# Altium schematic sheet PROB_S7CAS_FPGA_2.SchDoc
size Tabloid; SheetNumber: 6; SheetTotal: 15; Sheet_Name: Bank FPGA (2/3); Size: 11x17
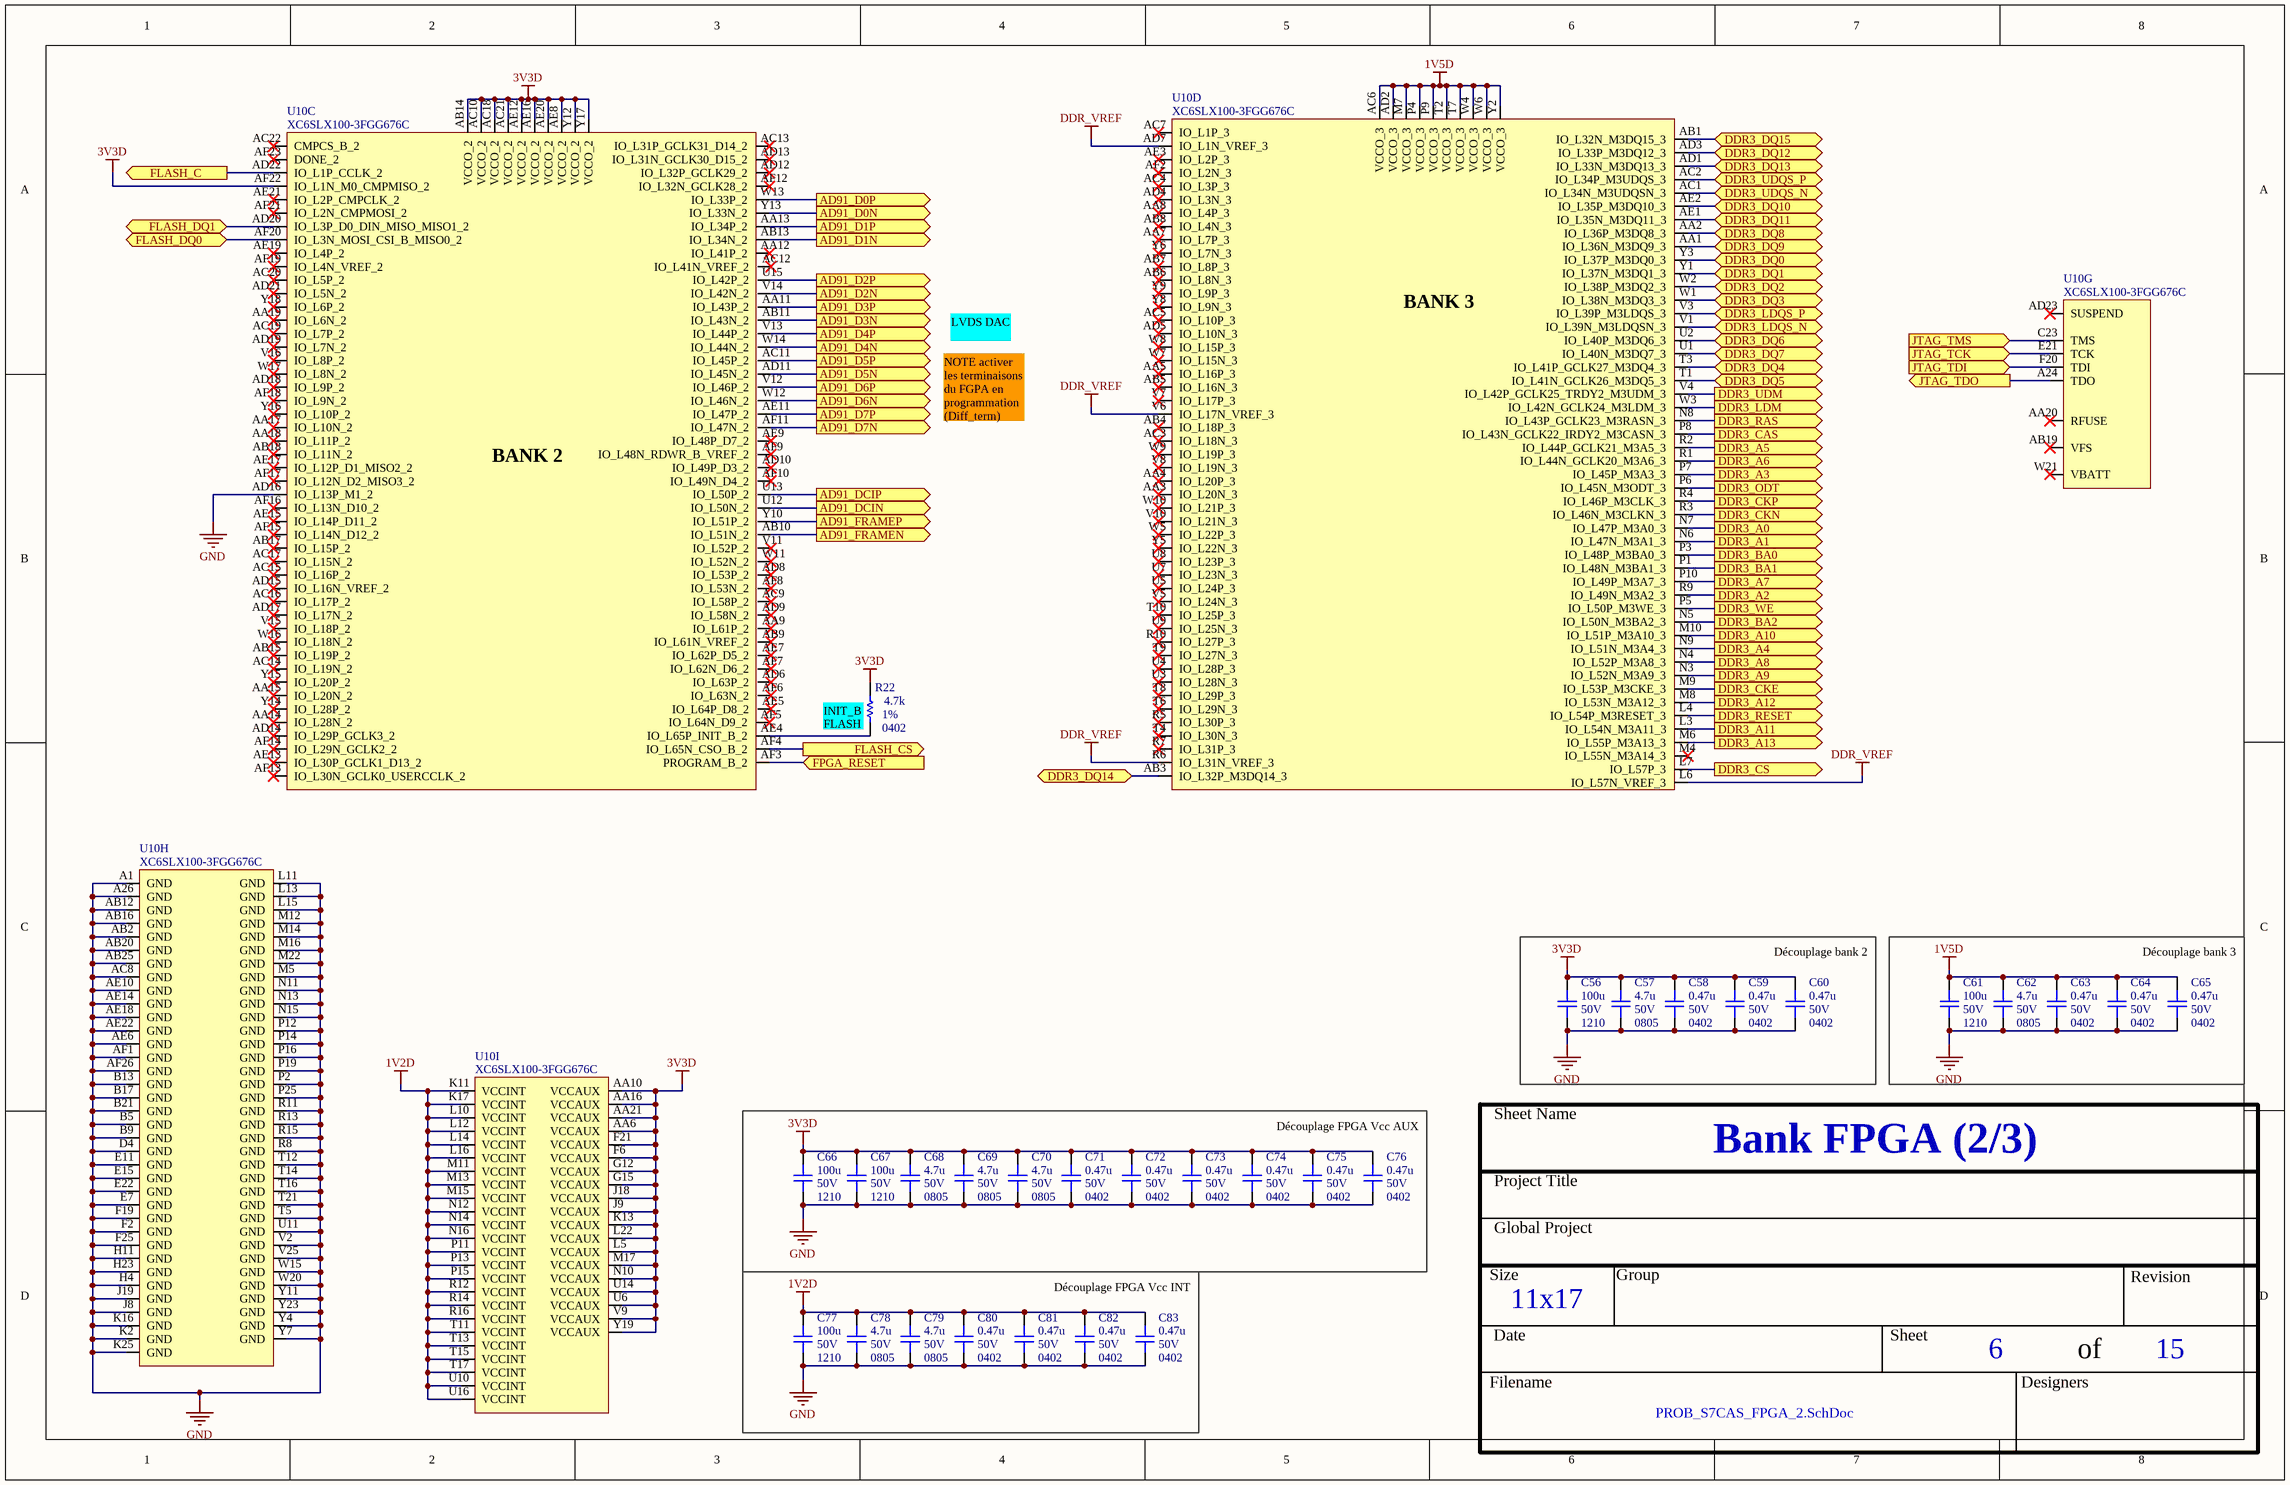
[diagram p0: PROB_S7CAS_FPGA_2.SchDoc]

## Parts
C56  value 100u  Voltage: 50V  Package: 1210  [CAP_1210]  (hidden comment: CAP - 1210)
C57  value 4.7u  Voltage: 50V  Package: 0805  [CAP_0805]  (hidden comment: CAP - 0805)
C58  value 0.47u  Voltage: 50V  Package: 0402  [CAP_0402]  (hidden comment: CAP - 0402)
C59  value 0.47u  Voltage: 50V  Package: 0402  [CAP_0402]  (hidden comment: CAP - 0402)
C60  value 0.47u  Voltage: 50V  Package: 0402  [CAP_0402]  (hidden comment: CAP - 0402)
C61  value 100u  Voltage: 50V  Package: 1210  [CAP_1210]  (hidden comment: CAP - 1210)
C62  value 4.7u  Voltage: 50V  Package: 0805  [CAP_0805]  (hidden comment: CAP - 0805)
C63  value 0.47u  Voltage: 50V  Package: 0402  [CAP_0402]  (hidden comment: CAP - 0402)
C64  value 0.47u  Voltage: 50V  Package: 0402  [CAP_0402]  (hidden comment: CAP - 0402)
C65  value 0.47u  Voltage: 50V  Package: 0402  [CAP_0402]  (hidden comment: CAP - 0402)
C66  value 100u  Voltage: 50V  Package: 1210  [CAP_1210]  (hidden comment: CAP - 1210)
C67  value 100u  Voltage: 50V  Package: 1210  [CAP_1210]  (hidden comment: CAP - 1210)
C68  value 4.7u  Voltage: 50V  Package: 0805  [CAP_0805]  (hidden comment: CAP - 0805)
C69  value 4.7u  Voltage: 50V  Package: 0805  [CAP_0805]  (hidden comment: CAP - 0805)
C70  value 4.7u  Voltage: 50V  Package: 0805  [CAP_0805]  (hidden comment: CAP - 0805)
C71  value 0.47u  Voltage: 50V  Package: 0402  [CAP_0402]  (hidden comment: CAP - 0402)
C72  value 0.47u  Voltage: 50V  Package: 0402  [CAP_0402]  (hidden comment: CAP - 0402)
C73  value 0.47u  Voltage: 50V  Package: 0402  [CAP_0402]  (hidden comment: CAP - 0402)
C74  value 0.47u  Voltage: 50V  Package: 0402  [CAP_0402]  (hidden comment: CAP - 0402)
C75  value 0.47u  Voltage: 50V  Package: 0402  [CAP_0402]  (hidden comment: CAP - 0402)
C76  value 0.47u  Voltage: 50V  Package: 0402  [CAP_0402]  (hidden comment: CAP - 0402)
C77  value 100u  Voltage: 50V  Package: 1210  [CAP_1210]  (hidden comment: CAP - 1210)
C78  value 4.7u  Voltage: 50V  Package: 0805  [CAP_0805]  (hidden comment: CAP - 0805)
C79  value 4.7u  Voltage: 50V  Package: 0805  [CAP_0805]  (hidden comment: CAP - 0805)
C80  value 0.47u  Voltage: 50V  Package: 0402  [CAP_0402]  (hidden comment: CAP - 0402)
C81  value 0.47u  Voltage: 50V  Package: 0402  [CAP_0402]  (hidden comment: CAP - 0402)
C82  value 0.47u  Voltage: 50V  Package: 0402  [CAP_0402]  (hidden comment: CAP - 0402)
C83  value 0.47u  Voltage: 50V  Package: 0402  [CAP_0402]  (hidden comment: CAP - 0402)
R22  value 4.7k  Package: 0402  Precision: 1%  [RES_0402]  (hidden comment: RES - 0402)
U10  XC6SLX100-3FGG676C  [FPGA_XILINX_FGG676]  (parts C,D,G,H,I of 10)

## Ports
AD91_D0N (out), AD91_D0P (out), AD91_D1N (out), AD91_D1P (out), AD91_D2N (out), AD91_D2P (out), AD91_D3N (out), AD91_D3P (out), AD91_D4N (out), AD91_D4P (out), AD91_D5N (out), AD91_D5P (out), AD91_D6N (out), AD91_D6P (out), AD91_D7N (out), AD91_D7P (out), AD91_DCIN (out), AD91_DCIP (out), AD91_FRAMEN (out), AD91_FRAMEP (out), DDR3_A0 (out), DDR3_A1 (out), DDR3_A2 (out), DDR3_A3 (out), DDR3_A4 (out), DDR3_A5 (out), DDR3_A6 (out), DDR3_A7 (out), DDR3_A8 (out), DDR3_A9 (out), DDR3_A10 (out), DDR3_A11 (out), DDR3_A12 (out), DDR3_A13 (out), DDR3_BA0 (out), DDR3_BA1 (out), DDR3_BA2 (out), DDR3_CAS (out), DDR3_CKE (out), DDR3_CKN (out), DDR3_CKP (out), DDR3_CS (out), DDR3_DQ0 (bidir), DDR3_DQ1 (bidir), DDR3_DQ2 (bidir), DDR3_DQ3 (bidir), DDR3_DQ4 (bidir), DDR3_DQ5 (bidir), DDR3_DQ6 (bidir), DDR3_DQ7 (bidir), DDR3_DQ8 (bidir), DDR3_DQ9 (bidir), DDR3_DQ10 (bidir), DDR3_DQ11 (bidir), DDR3_DQ12 (bidir), DDR3_DQ13 (bidir), DDR3_DQ14 (bidir), DDR3_DQ15 (bidir), DDR3_LDM (out), DDR3_LDQS_N (bidir), DDR3_LDQS_P (bidir), DDR3_ODT (out), DDR3_RAS (out), DDR3_RESET (out), DDR3_UDM (out), DDR3_UDQS_N (bidir), DDR3_UDQS_P (bidir), DDR3_WE (out), FLASH_C (out), FLASH_CS (out), FLASH_DQ0 (bidir), FLASH_DQ1 (bidir), FPGA_RESET (in), JTAG_TCK (in), JTAG_TDI (in), JTAG_TDO (out), JTAG_TMS (in)

## Nets
1V2D: C77.2 C78.2 C79.2 C80.2 C81.2 C82.2 C83.2 U10.K11(VCCINT) U10.K17(VCCINT) U10.L10(VCCINT) U10.L12(VCCINT) U10.L14(VCCINT) U10.L16(VCCINT) U10.M11(VCCINT) U10.M13(VCCINT) U10.M15(VCCINT) U10.N12(VCCINT) U10.N14(VCCINT) U10.N16(VCCINT) U10.P11(VCCINT) U10.P13(VCCINT) U10.P15(VCCINT) U10.R12(VCCINT) U10.R14(VCCINT) U10.R16(VCCINT) U10.T11(VCCINT) U10.T13(VCCINT) U10.T15(VCCINT) U10.T17(VCCINT) U10.U10(VCCINT) U10.U16(VCCINT)
1V5D: C61.2 C62.2 C63.2 C64.2 C65.2 U10.AC6(VCCO_3) U10.AD2(VCCO_3) U10.M7(VCCO_3) U10.P4(VCCO_3) U10.P9(VCCO_3) U10.T2(VCCO_3) U10.T7(VCCO_3) U10.W4(VCCO_3) U10.W6(VCCO_3) U10.Y2(VCCO_3)
3V3D: C56.2 C57.2 C58.2 C59.2 C60.2 C66.2 C67.2 C68.2 C69.2 C70.2 C71.2 C72.2 C73.2 C74.2 C75.2 C76.2 R22.2 U10.AA6(VCCAUX) U10.AA10(VCCAUX) U10.AA16(VCCAUX) U10.AA21(VCCAUX) U10.AB14(VCCO_2) U10.AC10(VCCO_2) U10.AC18(VCCO_2) U10.AC21(VCCO_2) U10.AE8(VCCO_2) U10.AE12(VCCO_2) U10.AE16(VCCO_2) U10.AE20(VCCO_2) U10.AF22(IO_L1N_M0_CMPMISO_2) U10.F6(VCCAUX) U10.F21(VCCAUX) U10.G12(VCCAUX) U10.G15(VCCAUX) U10.J9(VCCAUX) U10.J18(VCCAUX) U10.K13(VCCAUX) U10.L5(VCCAUX) U10.L22(VCCAUX) U10.M17(VCCAUX) U10.N10(VCCAUX) U10.U6(VCCAUX) U10.U14(VCCAUX) U10.V9(VCCAUX) U10.Y12(VCCO_2) U10.Y17(VCCO_2) U10.Y19(VCCAUX)
DDR_VREF: U10.AD7(IO_L1N_VREF_3) U10.L6(IO_L57N_VREF_3) U10.R6(IO_L31N_VREF_3) U10.V6(IO_L17N_VREF_3)
GND: C56.1 C57.1 C58.1 C59.1 C60.1 C61.1 C62.1 C63.1 C64.1 C65.1 C66.1 C67.1 C68.1 C69.1 C70.1 C71.1 C72.1 C73.1 C74.1 C75.1 C76.1 C77.1 C78.1 C79.1 C80.1 C81.1 C82.1 C83.1 U10.A1(GND) U10.A26(GND) U10.AB2(GND) U10.AB12(GND) U10.AB16(GND) U10.AB20(GND) U10.AB25(GND) U10.AC8(GND) U10.AD16(IO_L13P_M1_2) U10.AE6(GND) U10.AE10(GND) U10.AE14(GND) U10.AE18(GND) U10.AE22(GND) U10.AF1(GND) U10.AF26(GND) U10.B5(GND) U10.B9(GND) U10.B13(GND) U10.B17(GND) U10.B21(GND) U10.D4(GND) U10.E7(GND) U10.E11(GND) U10.E15(GND) U10.E22(GND) U10.F2(GND) U10.F19(GND) U10.F25(GND) U10.H4(GND) U10.H11(GND) U10.H23(GND) U10.J8(GND) U10.J19(GND) U10.K2(GND) U10.K16(GND) U10.K25(GND) U10.L11(GND) U10.L13(GND) U10.L15(GND) U10.M5(GND) U10.M12(GND) U10.M14(GND) U10.M16(GND) U10.M22(GND) U10.N11(GND) U10.N13(GND) U10.N15(GND) U10.P2(GND) U10.P12(GND) U10.P14(GND) U10.P16(GND) U10.P19(GND) U10.P25(GND) U10.R8(GND) U10.R11(GND) U10.R13(GND) U10.R15(GND) U10.T5(GND) U10.T12(GND) U10.T14(GND) U10.T16(GND) U10.T21(GND) U10.U11(GND) U10.V2(GND) U10.V25(GND) U10.W15(GND) U10.W20(GND) U10.Y4(GND) U10.Y7(GND) U10.Y11(GND) U10.Y23(GND)
AD91_D0N: U10.Y13(IO_L33N_2) ; port AD91_D0N
AD91_D0P: U10.W13(IO_L33P_2) ; port AD91_D0P
AD91_D1N: U10.AB13(IO_L34N_2) ; port AD91_D1N
AD91_D1P: U10.AA13(IO_L34P_2) ; port AD91_D1P
AD91_D2N: U10.V14(IO_L42N_2) ; port AD91_D2N
AD91_D2P: U10.U15(IO_L42P_2) ; port AD91_D2P
AD91_D3N: U10.AB11(IO_L43N_2) ; port AD91_D3N
AD91_D3P: U10.AA11(IO_L43P_2) ; port AD91_D3P
AD91_D4N: U10.W14(IO_L44N_2) ; port AD91_D4N
AD91_D4P: U10.V13(IO_L44P_2) ; port AD91_D4P
AD91_D5N: U10.AD11(IO_L45N_2) ; port AD91_D5N
AD91_D5P: U10.AC11(IO_L45P_2) ; port AD91_D5P
AD91_D6N: U10.W12(IO_L46N_2) ; port AD91_D6N
AD91_D6P: U10.V12(IO_L46P_2) ; port AD91_D6P
AD91_D7N: U10.AF11(IO_L47N_2) ; port AD91_D7N
AD91_D7P: U10.AE11(IO_L47P_2) ; port AD91_D7P
AD91_DCIN: U10.U12(IO_L50N_2) ; port AD91_DCIN
AD91_DCIP: U10.U13(IO_L50P_2) ; port AD91_DCIP
AD91_FRAMEN: U10.AB10(IO_L51N_2) ; port AD91_FRAMEN
AD91_FRAMEP: U10.Y10(IO_L51P_2) ; port AD91_FRAMEP
DDR3_A0: U10.N7(IO_L47P_M3A0_3) ; port DDR3_A0
DDR3_A1: U10.N6(IO_L47N_M3A1_3) ; port DDR3_A1
DDR3_A2: U10.R9(IO_L49N_M3A2_3) ; port DDR3_A2
DDR3_A3: U10.P7(IO_L45P_M3A3_3) ; port DDR3_A3
DDR3_A4: U10.N9(IO_L51N_M3A4_3) ; port DDR3_A4
DDR3_A5: U10.R2(IO_L44P_GCLK21_M3A5_3) ; port DDR3_A5
DDR3_A6: U10.R1(IO_L44N_GCLK20_M3A6_3) ; port DDR3_A6
DDR3_A7: U10.P10(IO_L49P_M3A7_3) ; port DDR3_A7
DDR3_A8: U10.N4(IO_L52P_M3A8_3) ; port DDR3_A8
DDR3_A9: U10.N3(IO_L52N_M3A9_3) ; port DDR3_A9
DDR3_A10: U10.M10(IO_L51P_M3A10_3) ; port DDR3_A10
DDR3_A11: U10.L3(IO_L54N_M3A11_3) ; port DDR3_A11
DDR3_A12: U10.M8(IO_L53N_M3A12_3) ; port DDR3_A12
DDR3_A13: U10.M6(IO_L55P_M3A13_3) ; port DDR3_A13
DDR3_BA0: U10.P3(IO_L48P_M3BA0_3) ; port DDR3_BA0
DDR3_BA1: U10.P1(IO_L48N_M3BA1_3) ; port DDR3_BA1
DDR3_BA2: U10.N5(IO_L50N_M3BA2_3) ; port DDR3_BA2
DDR3_CAS: U10.P8(IO_L43N_GCLK22_IRDY2_M3CASN_3) ; port DDR3_CAS
DDR3_CKE: U10.M9(IO_L53P_M3CKE_3) ; port DDR3_CKE
DDR3_CKN: U10.R3(IO_L46N_M3CLKN_3) ; port DDR3_CKN
DDR3_CKP: U10.R4(IO_L46P_M3CLK_3) ; port DDR3_CKP
DDR3_CS: U10.L7(IO_L57P_3) ; port DDR3_CS
DDR3_DQ0: U10.Y3(IO_L37P_M3DQ0_3) ; port DDR3_DQ0
DDR3_DQ1: U10.Y1(IO_L37N_M3DQ1_3) ; port DDR3_DQ1
DDR3_DQ2: U10.W2(IO_L38P_M3DQ2_3) ; port DDR3_DQ2
DDR3_DQ3: U10.W1(IO_L38N_M3DQ3_3) ; port DDR3_DQ3
DDR3_DQ4: U10.T3(IO_L41P_GCLK27_M3DQ4_3) ; port DDR3_DQ4
DDR3_DQ5: U10.T1(IO_L41N_GCLK26_M3DQ5_3) ; port DDR3_DQ5
DDR3_DQ6: U10.U2(IO_L40P_M3DQ6_3) ; port DDR3_DQ6
DDR3_DQ7: U10.U1(IO_L40N_M3DQ7_3) ; port DDR3_DQ7
DDR3_DQ8: U10.AA2(IO_L36P_M3DQ8_3) ; port DDR3_DQ8
DDR3_DQ9: U10.AA1(IO_L36N_M3DQ9_3) ; port DDR3_DQ9
DDR3_DQ10: U10.AE2(IO_L35P_M3DQ10_3) ; port DDR3_DQ10
DDR3_DQ11: U10.AE1(IO_L35N_M3DQ11_3) ; port DDR3_DQ11
DDR3_DQ12: U10.AD3(IO_L33P_M3DQ12_3) ; port DDR3_DQ12
DDR3_DQ13: U10.AD1(IO_L33N_M3DQ13_3) ; port DDR3_DQ13
DDR3_DQ14: U10.AB3(IO_L32P_M3DQ14_3) ; port DDR3_DQ14
DDR3_DQ15: U10.AB1(IO_L32N_M3DQ15_3) ; port DDR3_DQ15
DDR3_LDM: U10.W3(IO_L42N_GCLK24_M3LDM_3) ; port DDR3_LDM
DDR3_LDQS_N: U10.V1(IO_L39N_M3LDQSN_3) ; port DDR3_LDQS_N
DDR3_LDQS_P: U10.V3(IO_L39P_M3LDQS_3) ; port DDR3_LDQS_P
DDR3_ODT: U10.P6(IO_L45N_M3ODT_3) ; port DDR3_ODT
DDR3_RAS: U10.N8(IO_L43P_GCLK23_M3RASN_3) ; port DDR3_RAS
DDR3_RESET: U10.L4(IO_L54P_M3RESET_3) ; port DDR3_RESET
DDR3_UDM: U10.V4(IO_L42P_GCLK25_TRDY2_M3UDM_3) ; port DDR3_UDM
DDR3_UDQS_N: U10.AC1(IO_L34N_M3UDQSN_3) ; port DDR3_UDQS_N
DDR3_UDQS_P: U10.AC2(IO_L34P_M3UDQS_3) ; port DDR3_UDQS_P
DDR3_WE: U10.P5(IO_L50P_M3WE_3) ; port DDR3_WE
FLASH_C: U10.AD22(IO_L1P_CCLK_2) ; port FLASH_C
FLASH_CS: U10.AF4(IO_L65N_CSO_B_2) ; port FLASH_CS
FLASH_DQ0: U10.AF20(IO_L3N_MOSI_CSI_B_MISO0_2) ; port FLASH_DQ0
FLASH_DQ1: U10.AD20(IO_L3P_D0_DIN_MISO_MISO1_2) ; port FLASH_DQ1
FPGA_RESET: U10.AF3(PROGRAM_B_2) ; port FPGA_RESET
JTAG_TCK: U10.E21(TCK) ; port JTAG_TCK
JTAG_TDI: U10.F20(TDI) ; port JTAG_TDI
JTAG_TDO: U10.A24(TDO) ; port JTAG_TDO
JTAG_TMS: U10.C23(TMS) ; port JTAG_TMS
NetR22_1: R22.1 U10.AE4(IO_L65P_INIT_B_2)

Not connected (* = marked no-connect by the designer): U10 AA3(IO_L20N_3)* AA4(IO_L20P_3)* AA5(IO_L16P_3)* AA7(IO_L7P_3)* AA8(IO_L4P_3)* AA9(IO_L61P_2)* AA12(IO_L41P_2)* AA14(IO_L28N_2)* AA15(IO_L20N_2)* AA17(IO_L10N_2)* AA18(IO_L11P_2)* AA19(IO_L6N_2)* AA20(RFUSE)* AB4(IO_L18P_3)* AB5(IO_L16N_3)* AB6(IO_L8N_3)* AB7(IO_L8P_3)* AB8(IO_L4N_3)* AB9(IO_L61N_VREF_2)* AB15(IO_L19P_2)* AB17(IO_L15P_2)* AB18(IO_L11N_2)* AB19(VFS)* AC3(IO_L18N_3)* AC4(IO_L3P_3)* AC5(IO_L10P_3)* AC7(IO_L1P_3)* AC9(IO_L58P_2)* AC12(IO_L41N_VREF_2)* AC13(IO_L31P_GCLK31_D14_2)* AC14(IO_L19N_2)* AC15(IO_L16P_2)* AC16(IO_L17P_2)* AC17(IO_L15N_2)* AC19(IO_L7P_2)* AC20(IO_L5P_2)* AC22(CMPCS_B_2)* AD4(IO_L3N_3)* AD5(IO_L10N_3)* AD6(IO_L63P_2)* AD8(IO_L53P_2)* AD9(IO_L58N_2)* AD10(IO_L49P_D3_2)* AD12(IO_L32P_GCLK29_2)* AD13(IO_L31N_GCLK30_D15_2)* AD14(IO_L29P_GCLK3_2)* AD15(IO_L16N_VREF_2)* AD17(IO_L17N_2)* AD18(IO_L9P_2)* AD19(IO_L7N_2)* AD21(IO_L5N_2)* AD23(SUSPEND)* AE3(IO_L2P_3)* AE5(IO_L64P_D8_2)* AE7(IO_L62P_D5_2)* AE9(IO_L48P_D7_2)* AE13(IO_L30P_GCLK1_D13_2)* AE15(IO_L14P_D11_2)* AE17(IO_L12P_D1_MISO2_2)* AE19(IO_L4P_2)* AE21(IO_L2P_CMPCLK_2)* AF2(IO_L2N_3)* AF5(IO_L64N_D9_2)* AF6(IO_L63N_2)* AF7(IO_L62N_D6_2)* AF8(IO_L53N_2)* AF9(IO_L48N_RDWR_B_VREF_2)* AF10(IO_L49N_D4_2)* AF12(IO_L32N_GCLK28_2)* AF13(IO_L30N_GCLK0_USERCCLK_2)* AF14(IO_L29N_GCLK2_2)* AF15(IO_L14N_D12_2)* AF16(IO_L13N_D10_2)* AF17(IO_L12N_D2_MISO3_2)* AF18(IO_L9N_2)* AF19(IO_L4N_VREF_2)* AF21(IO_L2N_CMPMOSI_2)* AF23(DONE_2)* M4(IO_L55N_M3A14_3)* R5(IO_L30P_3)* R7(IO_L31P_3)* R10(IO_L27P_3)* T4(IO_L30N_3)* T6(IO_L29N_3)* T8(IO_L29P_3)* T9(IO_L27N_3)* T10(IO_L25P_3)* U3(IO_L28N_3)* U4(IO_L28P_3)* U5(IO_L24P_3)* U7(IO_L23N_3)* U8(IO_L23P_3)* U9(IO_L25N_3)* V5(IO_L24N_3)* V7(IO_L17P_3)* V8(IO_L19N_3)* V10(IO_L21N_3)* V11(IO_L52P_2)* V15(IO_L18P_2)* V16(IO_L8P_2)* W5(IO_L22P_3)* W7(IO_L15N_3)* W8(IO_L15P_3)* W9(IO_L19P_3)* W10(IO_L21P_3)* W11(IO_L52N_2)* W16(IO_L18N_2)* W17(IO_L8N_2)* W21(VBATT)* Y5(IO_L22N_3)* Y6(IO_L7N_3)* Y8(IO_L9N_3)* Y9(IO_L9P_3)* Y14(IO_L28P_2)* Y15(IO_L20P_2)* Y16(IO_L10P_2)* Y18(IO_L6P_2)*

## Notes on the sheet
- LVDS DAC
- NOTE activer les terminaisons du FGPA en programmation (Diff_term)
- (near R22) INIT_B FLASH
- Découplage bank 2
- Découplage bank 3
- Découplage FPGA Vcc AUX
- Découplage FPGA Vcc INT
- Sheet Name
- Project Title
- Global Project
- Size
- Group
- Revision
- Date
- Sheet
- of
- Filename
- Designers
- (in symbol FPGA_XC6SLX100-3FGG676C, part C) BANK 2
- (in symbol FPGA_XC6SLX100-3FGG676C, part D) BANK 3

## Library data of the parts
C56 C61 C66 C67 C77 = CAP - 1210: Precision: 10%; Current: *; CreatedBy: Jonathan Bouchard
C57 C62 C68-C70 C78 C79 = CAP - 0805: Precision: 10%; Current: *; CreatedBy: Jonathan Bouchard; Power: *
C58-C60 C63-C65 C71-C76 C80-C83 = CAP - 0402: Precision: 10%; Current: *; CreatedBy: Jonathan Bouchard; Power: *
R22 = RES - 0402: Voltage: 50V; Power: 1/16W; Current: *; CreatedBy: Jonathan Bouchard
U10 = FPGA_XC6SLX100-3FGG676C: FPGA - XILINX SPARTAN 6 480 I/O - BGA-676; Voltage: 1.14 V ~ 1.26 V; Current: *; Power: *; Mfg: Xilinx; Mfg Part Number: XC6SLX100-3FGG676C; HelpURL: https://www.xilinx.com/support/documentation/data_sheets/ds162.pdf; CreatedBy: Jonathan Bouchard; Temperature: 0°C ~ 85°C (TJ); Value: *; Precision: *; Package: BGA-676; Supplier 1: Digikey; Supplier Part Number 1: 122-1760-ND